# Altium schematic sheet NBBC95水表.SchDoc
size A4
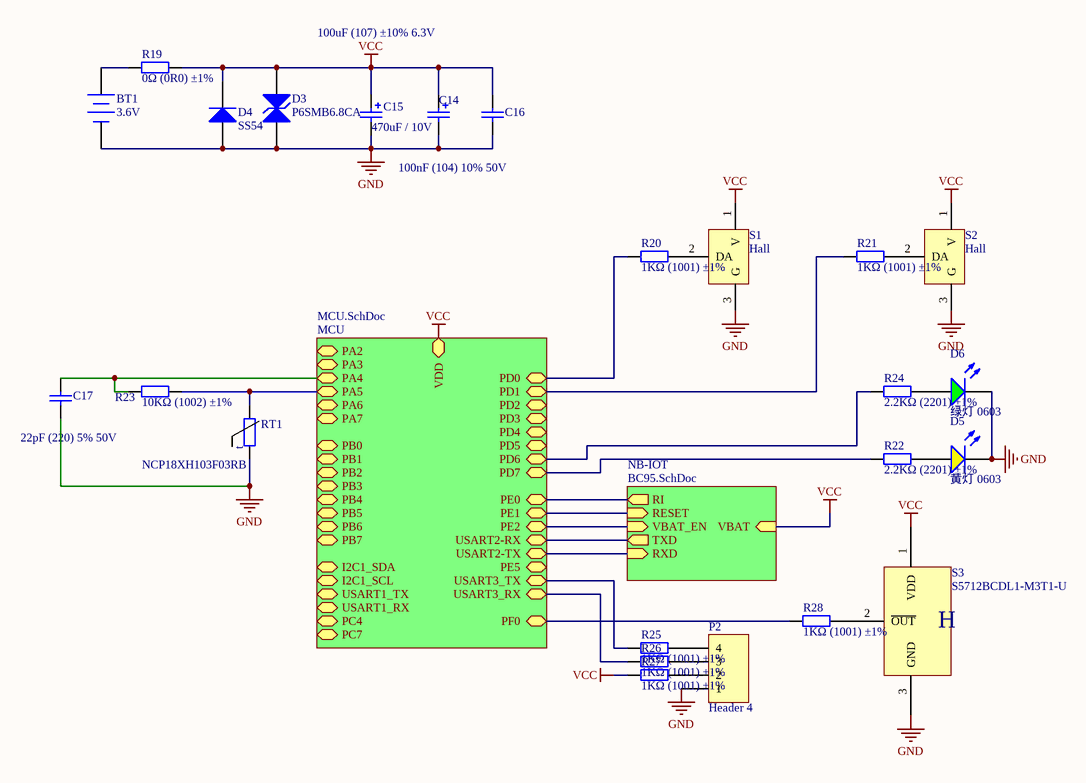
[diagram p0: NBBC95水表.SchDoc]

## Parts
BT1  3.6V  [电池连接焊线]
C14  100uF (107) ±10% 6.3V  [CASE-B_3528]
C15  470uF / 10V  [CASE-E_7343]
C16  100nF (104) 10% 50V  [0603_C]
C17  22pF (220) 5% 50V  [0603_C]
D3  P6SMB6.8CA  [SMB(DO-214AA)_S1]
D4  SS54  [SMA(DO-214AC)_S1]
D5  黄灯 0603  [0603_LED_S1]
D6  绿灯 0603  [0603_LED_S1]
P2  Header 4  [HDR1X4]
R19  0Ω (0R0) ±1%  [0805_R]
R20  1KΩ (1001) ±1%  [0603_R]
R21  1KΩ (1001) ±1%  [0603_R]
R22  2.2KΩ (2201) ±1%  [0603_R]
R23  10KΩ (1002) ±1%  [0603_R]
R24  2.2KΩ (2201) ±1%  [0603_R]
R25  1KΩ (1001) ±1%  [0603_R]
R26  1KΩ (1001) ±1%  [0603_R]
R27  1KΩ (1001) ±1%  [0603_R]
R28  1KΩ (1001) ±1%  [0603_R]
RT1  NCP18XH103F03RB  [0603_R]
S1  Hall  [霍尔转接板]
S2  Hall  [霍尔转接板]
S3  S5712BCDL1-M3T1-U  [SOT-23]

## Sub-sheets
MCU = MCU.SchDoc: PA2 (bidir), PA3 (bidir), PA4 (bidir), PA5 (bidir), PA6 (bidir), PA7 (bidir), PE0 (bidir), PE1 (bidir), PE2 (bidir), USART2-RX (bidir), USART2-TX (bidir), PE5 (bidir), PD0 (bidir), PD1 (bidir), PD2 (bidir), PD3 (bidir), PB0 (bidir), PB1 (bidir), PB2 (bidir), PB3 (bidir), PB4 (bidir), PB5 (bidir), PB6 (bidir), PB7 (bidir), PF0 (bidir), PD4 (bidir), PD5 (bidir), PD6 (bidir), PD7 (bidir), I2C1_SDA (bidir), I2C1_SCL (bidir), USART1_RX (bidir), USART1_TX (bidir), PC4 (bidir), PC7 (bidir), USART3_TX (bidir), USART3_RX (bidir), VDD
NB-IOT = BC95.SchDoc: VBAT (in), RESET (in), RXD (in), TXD (out), RI (out), VBAT_EN (in)

## Nets
GND: BT1.2(-) C14.2 C15.2 C16.2 C17.1 D3.1(A) D4.1(A) D5.K D6.K P2.1 RT1.1 S1.3(G) S2.3(G) S3.3(GND)
VCC: C14.1 C15.1 C16.1 D3.2(K) D4.2(K) R19.2 R27.2 S1.1(V) S2.1(V) S3.1(VDD) ; sheet MCU/VDD, sheet NB-IOT/VBAT
NetBT1_1: BT1.1(+) R19.1
NetC17_2: C17.2 R23.1 ; sheet MCU/PA4
NetD5_A: D5.A R22.2
NetD6_A: D6.A R24.2
NetP2_2: P2.2 R27.1
NetP2_3: P2.3 R26.1
NetP2_4: P2.4 R25.1
NetR20_1: R20.1 ; sheet MCU/PD0
NetR20_2: R20.2 S1.2(DA)
NetR21_1: R21.1 ; sheet MCU/PD1
NetR21_2: R21.2 S2.2(DA)
NetR22_1: R22.1 ; sheet MCU/PD7
NetR23_2: R23.2 RT1.2 ; sheet MCU/PA5
NetR24_1: R24.1 ; sheet MCU/PD6
NetR25_2: R25.2 ; sheet MCU/USART3_TX
NetR26_2: R26.2 ; sheet MCU/USART3_RX
NetR28_1: R28.1 ; sheet MCU/PF0
NetR28_2: R28.2 S3.2(~{OUT})
(unnamed): sheet MCU/PE0, sheet NB-IOT/RI
(unnamed): sheet MCU/PE1, sheet NB-IOT/RESET
(unnamed): sheet MCU/PE2, sheet NB-IOT/VBAT_EN
(unnamed): sheet MCU/USART2-RX, sheet NB-IOT/TXD
(unnamed): sheet MCU/USART2-TX, sheet NB-IOT/RXD

## Notes on the sheet
- (in symbol NCP18XH103F03RB) t
- (in symbol S5712) H

## Library data of the parts
BT1 = Battery: 功率型锂电池; Published: 24-Mar-1999; LatestRevisionDate: 17-Jul-2002; LatestRevisionNote: Re-released for DXP Platform.; PackageReference: BAT-2; Publisher: Altium Limited
C14 = 3528 100uF (107) 10% 6.3V: 钽电容; ComponentLink1Description: 供应商链接; ComponentLink1URL: http://www.szlcsc.com/product/details_16815.html; Package: 3528; Supplier: LC; SuppliersPartNumber: C16133
C15 = 法拉电容 0.5F: 钽电容; ComponentLink1Description: 供应商链接; ComponentLink1URL: http://www.szlcsc.com/product/details_16815.html; Package: 3528; Supplier: LC; SuppliersPartNumber: C16133
C16 = 0603 100nF (104) 10% 50V: 贴片电容; ComponentLink1Description: 供应商链接; ComponentLink1URL: http://www.szlcsc.com/product/details_15331.html; Package: 0603; Supplier: LC; SuppliersPartNumber: C14663
C17 = 0603 22pF (220) 5% 50V: 贴片电容; ComponentLink1Description: 供应商链接; ComponentLink1URL: http://www.szlcsc.com/product/details_2005.html; Package: 0603; Supplier: LC; SuppliersPartNumber: C1653
D3 = SMB/DO-214AA P6SMB6.8CA: TVS; ComponentLink1Description: 供应商链接; ComponentLink1URL: http://www.szlcsc.com/product/details_79530.html; Package: SMB/DO-214AA; Supplier: LC; SuppliersPartNumber: C78395
D4 = SMA(DO-214AC) SS54: 二极管; ComponentLink1Description: 供应商链接; ComponentLink1URL: http://www.szlcsc.com/product/details_23178.html; Package: SMA(DO-214AC); Supplier: LC; SuppliersPartNumber: C22452
D5 = 0603 黄灯: 发光二极管; ComponentLink1Description: 供应商链接; ComponentLink1URL: http://www.szlcsc.com/product/details_73147.html; Package: 0603; Supplier: LC; SuppliersPartNumber: C72038
D6 = 0603 绿灯: 发光二极管; ComponentLink1Description: 供应商链接; ComponentLink1URL: http://www.szlcsc.com/product/details_73152.html; Package: 0603; Supplier: LC; SuppliersPartNumber: C72043
P2 = Header 4: Header, 4-Pin; LatestRevisionDate: 17-Jul-2002; LatestRevisionNote: Re-released for DXP Platform.; Publisher: Altium Limited
R19 = 0805 0Ω (0R0) 1%: 贴片电阻; ComponentLink1Description: 供应商链接; ComponentLink1URL: http://www.szlcsc.com/product/details_18165.html; Package: 0805; Supplier: LC; SuppliersPartNumber: C17477
R20 R21 R25-R28 = 0603 1KΩ (1001) 1%: 贴片电阻; ComponentLink1Description: 供应商链接; ComponentLink1URL: http://www.szlcsc.com/product/details_21904.html; Package: 0603; Supplier: LC; SuppliersPartNumber: C21190
R22 R24 = 0603 2.2KΩ (2201) 1%: 贴片电阻; ComponentLink1Description: 供应商链接; ComponentLink1URL: http://www.szlcsc.com/product/details_4597.html; Package: 0603; Supplier: LC; SuppliersPartNumber: C4190
R23 = 0603 10KΩ (1002) 1%: 贴片电阻; ComponentLink1Description: 供应商链接; ComponentLink1URL: http://www.szlcsc.com/product/details_26547.html; Package: 0603; Supplier: LC; SuppliersPartNumber: C25804
RT1 = NCP18XH103F03RB: 热敏电阻
S1 S2 = 霍尔开关转接板
S3 = S5712